# Altium project PROJ.PrjPcb
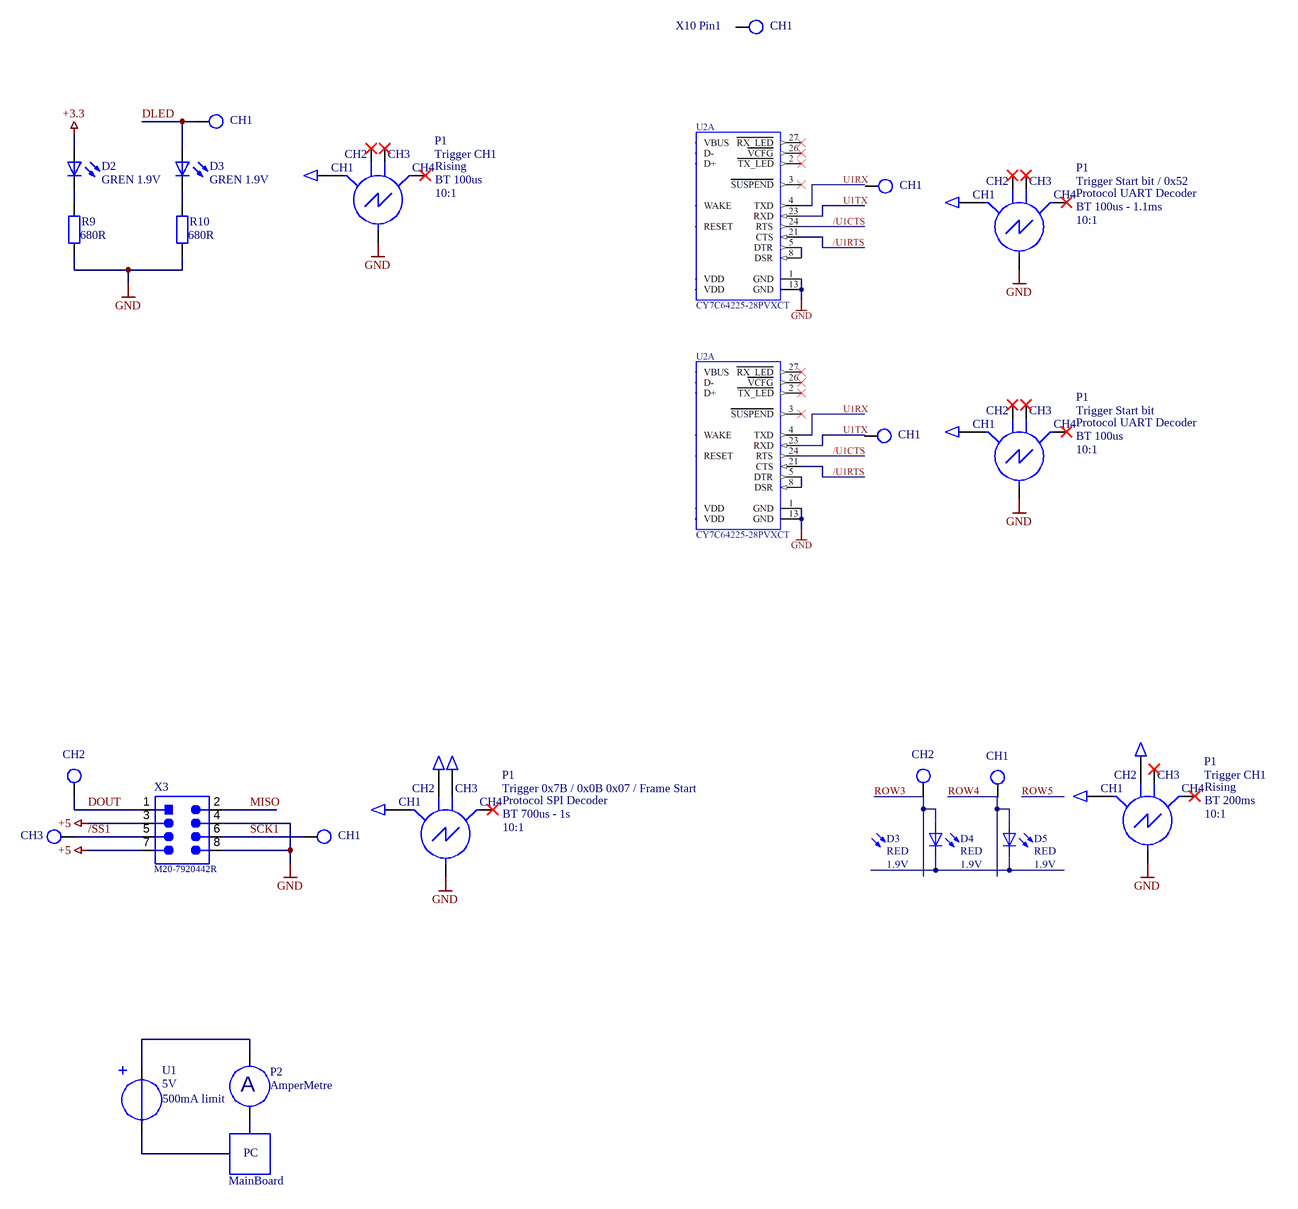
[diagram p0: PROJ.SchDoc]
1 sheet, 30 parts. Net scope: global (net labels, ports and power ports of the same name join across sheets).
Board file: ES_Class6C_2L.PcbDoc

## Sheet PROJ.SchDoc
size 420 x 297 mm; SheetNumber: 1; SheetTotal: 1

### Parts
(Parts that share a designator on the sheet are numbered #1, #2 ... from top to bottom, then left to right.)
?#1  OscilloPoint  (value not drawn)
?#2  OscilloPoint  (value not drawn)
?#3  OscilloPoint  (value not drawn)
?#4  OscilloPoint  (value not drawn)
?#5  OscilloPoint  (value not drawn)
?#6  OscilloPoint  (value not drawn)
?#7  OscilloPoint  (value not drawn)
?#8  OscilloPoint  (value not drawn)
CH1#1  X10 Pin1
CH1#2  (no value)
CH1#3  X10 Pin1  (value not drawn)
CH1#4  X10 Pin1  (value not drawn)
CH1#5  X10 Pin1  (value not drawn)
CH1#6  X10 Pin1  (value not drawn)
CH2#1  X10 Pin1  (value not drawn)
CH2#2  X10 Pin1  (value not drawn)
CH3  X10 Pin1  (value not drawn)
D2  GREN 1.9V  [LED_0805]
D3  GREN 1.9V  [LED_0805]
P1#1  Trigger CH1
P1#2  Trigger Start bit / 0x52
P1#3  Trigger Start bit
P1#4  Trigger CH1
P1#5  Trigger 0x7B / 0x0B 0x07 / Frame Start
P2  AmperMetre
R9  680R  [RESC2013X70X40ML20T20]
R10  680R  [RESC2013X70X40ML20T20]
U1  5V
X3  M20-7920442R  [610108249121]
X?  MainBoard

### Nets
+3.3: D2.A
+5: X3.3 X3.7
GND: P1#1.21 P1#2.21 P1#3.21 P1#4.21 P1#5.21 R9.1 R10.1 X3.4 X3.8
/SS1: CH3.15 X3.5
DLED: CH1#2.15 D3.A
DOUT: CH2#1.15 X3.1
MISO: X3.2
SCK1: CH1#6.15 X3.6
Net?#1_15: ?#1.15 P1#1.18
Net?#2_15: ?#2.15 P1#2.18
Net?#3_15: ?#3.15 P1#3.18
Net?#4_15: ?#4.15 P1#4.19
Net?#5_15: ?#5.15 P1#5.19
Net?#6_15: ?#6.15 P1#5.20
Net?#7_15: ?#7.15 P1#4.18
Net?#8_15: ?#8.15 P1#5.18
NetD2_K: D2.K R9.2
NetD3_K: D3.K R10.2
NetP2_21: P2.21 U1.21

Not connected (* = marked no-connect by the designer): CH1#1 15; CH1#3 15; CH1#4 15; CH1#5 15; CH2#2 15; P1#1 17* 19* 20*; P1#2 17* 19* 20*; P1#3 17* 19* 20*; P1#4 17* 20*; P1#5 17*

### Notes on the sheet
- (near P1#1) Rising
- (near P1#1) BT 100us
- (near P1#1) 10:1
- (near P1#2) Protocol UART Decoder
- (near P1#2) BT 100us - 1.1ms
- (near P1#2) 10:1
- (near P1#3) Protocol UART Decoder
- (near P1#3) BT 100us
- (near P1#3) 10:1
- (near P1#5) Protocol SPI Decoder
- (near P1#5) BT 700us - 1s
- (near P1#5) 10:1
- (near P1#4) Rising
- (near P1#4) BT 200ms
- (near P1#4) 10:1
- 500mA limit
- THIS DOCUMENT AND THE DATA DISCLOSED HEREIN OR
- HEREWITH IS THE PROPERTY OF ALTIUM LIMITED AND MAY
- DWG NO:
- REVISION
- REV:
- DESCRIPTION
- DATE
- APPROVED
- BE FREELY DISTRIBUTED IN WHOLE. NO RIGHTS ARE
- RESERVED OR EXPRESS OR IMPLIED WARANTEE GIVEN.
- ENG:
- APPROVALS
- PROJECT
- DSN:
- CHK:
- REFERENCE DOCUMENTS
- PROJECT REVISION:
- TITLE
- DOCUMENT REVISION:
- DESIGN ITEM:
- BOM:
- FAB DWG:
- PCB DWG:
- ASSY DWG:
- SCALE:
- A3
- SIZE
- CAGE CODE
- FILE NAME
- DWG NO.
- SHEET
- OF
- REV
- (in symbol AmperMetre) A
- (in symbol Oscillo) CH2; CH3; CH1; CH4

### Library data of the parts
CH1#1-CH1#6 CH2#1 CH2#2 CH3 = TP
D2 D3 = 151031VS04000_G: WL-TMRC THT Mono-color Round Color, size 3mm, Bright Green, 2.1V, 40deg; Luminous Intensity: 120mcd; Dominant Wavelength: 570nm; Peak Wavelength: 573nm; Chip Technology: AlInGaP; ComponentLink1Description: Manufacturer; ComponentLink1URL: http://www.we-online.de; ComponentLink2Description: Datasheet; ComponentLink2URL: https://katalog.we-online.de/led/datasheet/151031VS04000.pdf; Emitting Color: Bright Green; Operating Temperature: -40 to +85degC; Mounting Technology: THT; Forward Voltage: 2.1V; Part Number: 151031VS04000; Packaging: Bulk; Published Date: January 2021; Publisher: Wurth Elektronik; Size: 3mm; Viewing Angle: 40deg
P1#1-P1#5 = Oscillo
R9 R10 = CMP-1013-00623-1: 10K 0.125W 1% 0805 (2012 Metric)  SMD; Manufacturer 1: Vishay Dale; Manufacturer Part Number 1: CRCW080510K0FKEC; Manufacturer 10: Panasonic; Manufacturer Part Number 10: ERJ-6ENF1002V; Case-Metric: 2012; Case-EIA: 0805; Tolerance: 1 %; Technology: SMT; Supplier 1: Digi-Key; Supplier Part Number 1: 541-10.0KCCT-ND; Manufacturer 2: Yageo; Manufacturer Part Number 2: RC0805FR-0710KL; Manufacturer 3: Vishay Dale; Manufacturer Part Number 3: CRCW080510K0FKTC; Manufacturer 4: Vishay Dale; Manufacturer Part Number 4: CRCW080510K0FKEB; Manufacturer 5: Bourns; Manufacturer Part Number 5: CR0805-FX-1002ELF; Manufacturer 6: Rohm; Manufacturer Part Number 6: MCR10EZPF1002; Manufacturer 7: Vishay; Manufacturer Part Number 7: CRCW080510K0FKEA; Manufacturer 8: Vishay Dale; Manufacturer Part Number 8: CRCW080510K0FKTB; Manufacturer 9: Vishay Dale; Manufacturer Part Number 9: CRCW080510K0FKTA; Value: 10k; Power: 0.125 W
U1 = Alimentation
X3 = 610108249121: WR-PHD Pin Header, THT, pitch 2.54mm, Dual Row, Angled, 8p; Manufacturer Part Number: 61300821021; Manufacturer: Wurth Elektronik; Pin Number: 8; Rated Current: 3A; Working Voltage: 250VAC; Withstanding Voltage: 500VAC; Contact Resistance: 20mOhm; ComponentLink1Description: Manufacturer; ComponentLink1URL: http://www.we-online.de; ComponentLink2Description: Datasheet; ComponentLink2URL: https://www.we-online.com/catalog/datasheet/61300821021.pdf; Pitch: 2.54mm; Operating Temperature: -40 to +105degC; Mounting Technology: THT; Packaging: Bag; Gender: Pin Header; Row Number: Dual; Orientation: Angled
X? = PC